# Altium schematic sheet PICV2.SchDoc
size B
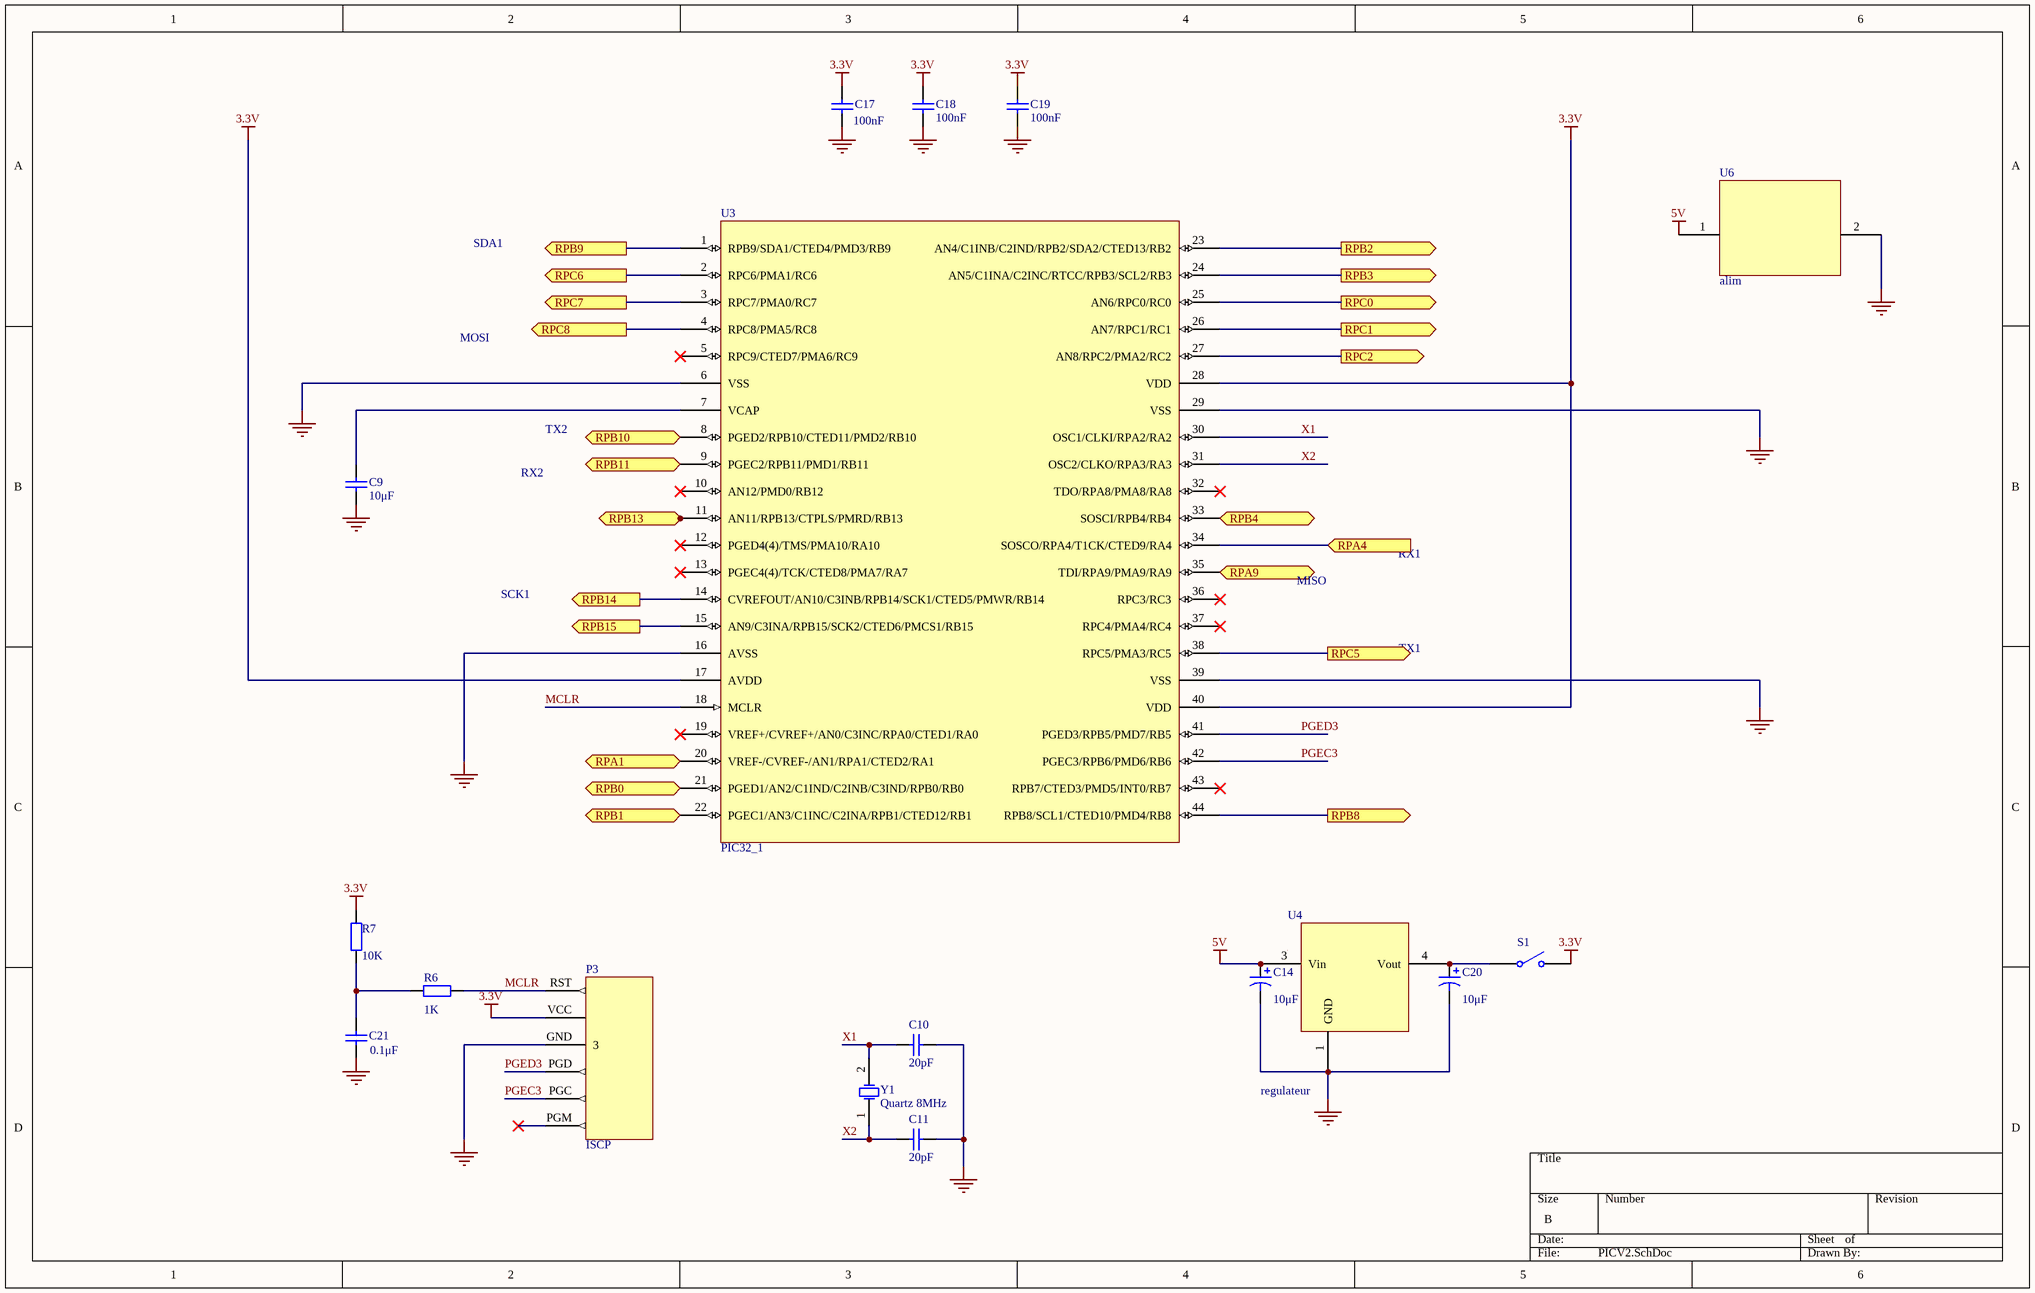
[diagram p0: PICV2.SchDoc]

## Parts
C9  value 10μF  [0603]  (hidden comment: Cap)
C10  value 20pF  [0603]  (hidden comment: Cap)
C11  value 20pF  [0603]  (hidden comment: Cap)
C14  value 10μF  [0603]  (hidden comment: Cap Pol1)
C17  value 100nF  [0603]  (hidden comment: Cap)
C18  value 100nF  [0603]  (hidden comment: Cap)
C19  value 100nF  [0603]  (hidden comment: Cap)
C20  value 10μF  [0603]  (hidden comment: Cap Pol1)
C21  value 0.1μF  [0603]  (hidden comment: Cap)
P3  ISCP  [ISCP]
R6  value 1K  [0603]  (hidden comment: Res2)
R7  value 10K  [0603]  (hidden comment: Res2)
S1  SW-SPST  [SPST-2]  (value not drawn)
U3  PIC32_1  [PIC32]
U4  regulateur  [regulateur]
U6  alim  [Alim]
Y1  Quartz 8MHz  [quartz]

## Ports
RPA1 (out), RPA4 (in), RPA9 (in), RPB0 (out), RPB1 (out), RPB2 (out), RPB3 (out), RPB4 (out), RPB8 (out), RPB9 (out), RPB10 (out), RPB11 (in), RPB13 (out), RPB14 (out), RPB15 (out), RPC0 (out), RPC1 (out), RPC2 (out), RPC5 (out), RPC6 (out), RPC7 (out), RPC8 (out)

## Nets
3.3V: C17.2 C18.1 C19.1 P3.VCC R7.2 S1.2(NO) U3.17(AVDD) U3.28(VDD) U3.40(VDD)
5V: C14.1 U4.3(Vin) U6.1
GND: C9.2 C10.1 C11.1 C14.2 C17.1 C18.2 C19.2 C20.2 C21.1 P3.GND(3) U3.6(VSS) U3.16(AVSS) U3.29(VSS) U3.39(VSS) U4.1(GND) U6.2
MCLR: P3.RST R6.2 U3.18(MCLR)
PGEC3: P3.PGC U3.42(PGEC3/RPB6/PMD6/RB6)
PGED3: P3.PGD U3.41(PGED3/RPB5/PMD7/RB5)
RPA1: U3.20(VREF-/CVREF-/AN1/RPA1/CTED2/RA1) ; port RPA1
RPA4: U3.34(SOSCO/RPA4/T1CK/CTED9/RA4) ; port RPA4
RPA9: U3.35(TDI/RPA9/PMA9/RA9) ; port RPA9
RPB0: U3.21(PGED1/AN2/C1IND/C2INB/C3IND/RPB0/RB0) ; port RPB0
RPB1: U3.22(PGEC1/AN3/C1INC/C2INA/RPB1/CTED12/RB1) ; port RPB1
RPB2: U3.23(AN4/C1INB/C2IND/RPB2/SDA2/CTED13/RB2) ; port RPB2
RPB3: U3.24(AN5/C1INA/C2INC/RTCC/RPB3/SCL2/RB3) ; port RPB3
RPB4: U3.33(SOSCI/RPB4/RB4) ; port RPB4
RPB8: U3.44(RPB8/SCL1/CTED10/PMD4/RB8) ; port RPB8
RPB9: U3.1(RPB9/SDA1/CTED4/PMD3/RB9) ; port RPB9
RPB10: U3.8(PGED2/RPB10/CTED11/PMD2/RB10) ; port RPB10
RPB11: U3.9(PGEC2/RPB11/PMD1/RB11) ; port RPB11
RPB14: U3.14(CVREFOUT/AN10/C3INB/RPB14/SCK1/CTED5/PMWR/RB14) ; port RPB14
RPB15: U3.15(AN9/C3INA/RPB15/SCK2/CTED6/PMCS1/RB15) ; port RPB15
RPC0: U3.25(AN6/RPC0/RC0) ; port RPC0
RPC1: U3.26(AN7/RPC1/RC1) ; port RPC1
RPC2: U3.27(AN8/RPC2/PMA2/RC2) ; port RPC2
RPC5: U3.38(RPC5/PMA3/RC5) ; port RPC5
RPC6: U3.2(RPC6/PMA1/RC6) ; port RPC6
RPC7: U3.3(RPC7/PMA0/RC7) ; port RPC7
RPC8: U3.4(RPC8/PMA5/RC8) ; port RPC8
X1: C10.2 U3.30(OSC1/CLKI/RPA2/RA2) Y1.2(OSC2)
X2: C11.2 U3.31(OSC2/CLKO/RPA3/RA3) Y1.1(OSC1)
NetC9_1: C9.1 U3.7(VCAP)
NetC20_1: C20.1 S1.1(COMMON) U4.4(Vout)
NetC21_2: C21.2 R6.1 R7.1

Not connected (* = marked no-connect by the designer): P3 PGM(6)*; U3 5(RPC9/CTED7/PMA6/RC9)* 10(AN12/PMD0/RB12)* 11(AN11/RPB13/CTPLS/PMRD/RB13) 12(PGED4(4)/TMS/PMA10/RA10)* 13(PGEC4(4)/TCK/CTED8/PMA7/RA7)* 19(VREF+/CVREF+/AN0/C3INC/RPA0/CTED1/RA0)* 32(TDO/RPA8/PMA8/RA8)* 36(RPC3/RC3)* 37(RPC4/PMA4/RC4)* 43(RPB7/CTED3/PMD5/INT0/RB7)*

## Notes on the sheet
- SDA1
- MOSI
- TX2
- RX2
- MISO
- RX1
- SCK1
- TX1

## Library data of the parts
C9-C11 C17-C19 C21 = Cap: Capacitor; Published: 8-Jun-2000; LatestRevisionDate: 17-Jul-2002; LatestRevisionNote: Re-released for DXP Platform.; PackageReference: RAD-0.3; Publisher: Altium Limited; PackageDescription: Radial Cap, Thru-Hole; 2 Leads; 0.3 in Pin Spacing
C14 = Cap Pol1: Polarized Capacitor (Radial); FOURNISSEUR: FARNELL; FABRIQUANT: TDK; REF FABRIQUANT: C1608X5R0J106K080AB; REF FOURNISSEUR: 2346889; Published: 8-Jun-2000; LatestRevisionDate: 17-Jul-2002; LatestRevisionNote: Re-released for DXP Platform.; PackageReference: RB7.6-15; Publisher: Altium Limited; PackageDescription: Polarized Capacitor (Radial); 2 Leads
C20 = Cap Pol1: Polarized Capacitor (Radial); FABRIQUANT: TDK; FOURNISSEUR: FARNELL; REF FABRIQUANT: C1608X5R0J106K080AB; REF FOURNISSEUR: 2346889; Published: 8-Jun-2000; LatestRevisionDate: 17-Jul-2002; LatestRevisionNote: Re-released for DXP Platform.; PackageReference: RB7.6-15; Publisher: Altium Limited; PackageDescription: Polarized Capacitor (Radial); 2 Leads
P3 = ISCP: FOURNISSEUR: Farnell; FABRIQUANT: Molex; REF FOURNISSEUR: 1360134; REF FABRIQUANT: 22-29-2061
R6 R7 = Res2: Resistor; Published: 8-Jun-2000; LatestRevisionDate: 17-Jul-2002; LatestRevisionNote: Re-released for DXP Platform.; PackageReference: AXIAL-0.4; Publisher: Altium Limited; PackageDescription: Axial Device, Thru-Hole; 2 Leads; 0.4 in Pin Spacing
S1 = SW-SPST: Single-Pole, Single-Throw Switch; Published: 24-Mar-1999; LatestRevisionDate: 17-Jul-2002; LatestRevisionNote: Re-released for DXP Platform.; PackageReference: SPST-2; Publisher: Altium Limited; PackageDescription: Switch; 2 Leads
U3 = PIC32_1: FOURNISSEUR: FARNELL; FABRIQUANT: MICROCHIP; REF FOURNISSEUR: PIC32MX170F256D-I/PT; REF FABRIQUANT: 2456845
U4 = regulateur: FOURNISSEUR: FARNELL; FABRIQUANT: TEXAS INSTRUMENTS; REF FABRIQUANT: LM1117DT-3.3/NOPB; REF FOURNISSEUR: 1469048
U6 = alim: FOURNISSEUR: Farnell; FABRIQUANT: Lumberg; REF FABRIQUANT: 1613 09; REF FOURNISSEUR: 1216991
Y1 = XTAL: Crystal Oscillator; FABRIQUANT: FOX ELECTRONICS; FOURNISSEUR: FARNELL; REF FABRIQUANT: FOXSDLF/080-20; REF FOURNISSEUR: 2063972; Published: 8-Jun-2000; LatestRevisionDate: 17-Jul-2002; LatestRevisionNote: Re-released for DXP Platform.; PackageReference: R38; Publisher: Altium Limited; PackageDescription: Crystal, Thru-Hole; 2 Leads; Body 3.1 x 8.2 mm (Dia.xH)